# EAGLE schematic termostat_ESP32 (EAGLE 9.0.1)
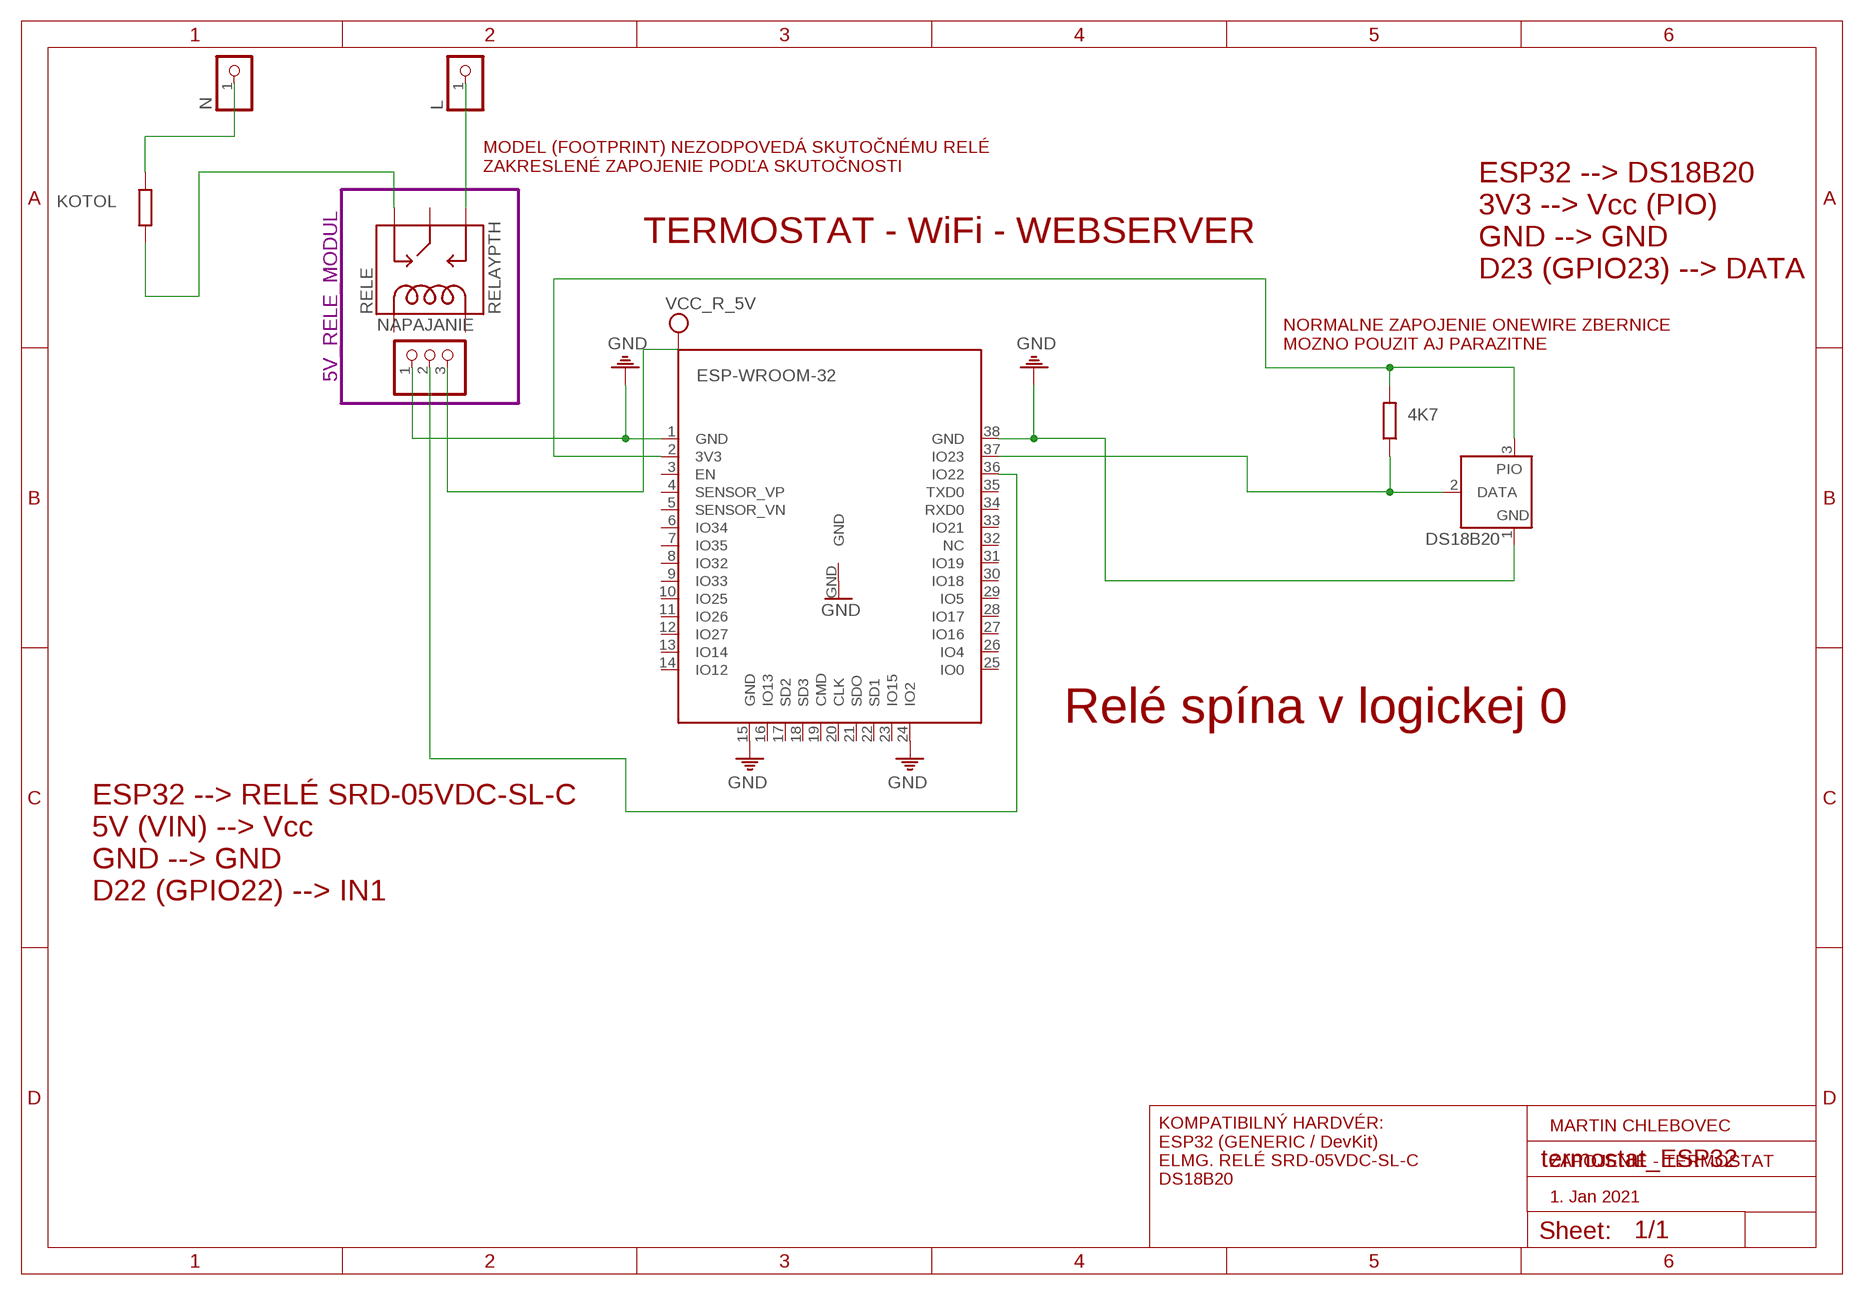
[diagram p0: schematic, sheet 1]

## Parts
IC1  DS2405  [TO92-]
L  PINHD-1X1CB  [1X01-CLEANBIG]
N  PINHD-1X1CB  [1X01-CLEANBIG]
NAPAJANIE  PINHD-1X3  [1X03]
RELE  RELAYPTH  [SRD-05VDC-SL-C]
U1  ESP-WROOM-32  [ESP-WROOM-32]

## Module instances
5V_RELE_MODUL = RELE

## Nets
N$3: NAPAJANIE.2 U1.36(IO22)
N$8: IC1.2(DATA) U1.37(IO23)
N$9: IC1.3(PIO) U1.2(3V3)
N$11: L.1 RELE.SWOPEN
N$12: N.1
N$13: RELE.SWCLOSED(SWCLOSE)
PE [gnd]: IC1.1(GND) NAPAJANIE.1 U1.1(GND) U1.15(GND) U1.24(IO2) U1.38(GND) ; supply symbol labelled GND
VCC: NAPAJANIE.3 ; supply symbol labelled VCC_R_5V
Unconnected: RELE.COIL0 RELE.COIL1 RELE.SWCOMMON U1.3(EN) U1.4(SENSOR_VP) U1.5(SENSOR_VN) U1.6(IO34) U1.7(IO35) U1.8(IO32) U1.9(IO33) U1.10(IO25) U1.11(IO26) U1.12(IO27) U1.13(IO14) U1.14(IO12) U1.16(IO13) U1.17(SD2) U1.18(SD3) U1.19(CMD) U1.20(CLK) U1.21(SDO) U1.22(SD1) U1.23(IO15) U1.25(IO0) U1.26(IO4) U1.27(IO16) U1.28(IO17) U1.29(IO5) U1.30(IO18) U1.31(IO19) U1.32(NC) U1.33(IO21) U1.34(RXD0) U1.35(TXD0) U1.GND

## Notes on the sheet
- MODEL (FOOTPRINT) NEZODPOVEDÁ SKUTOČNÉMU RELÉ
  ZAKRESLENÉ ZAPOJENIE PODĽA SKUTOČNOSTI
- KOTOL
- TERMOSTAT - WiFi - WEBSERVER
- ESP32 --> DS18B20
  3V3 --> Vcc (PIO)
  GND --> GND
  D23 (GPIO23) --> DATA
- NORMALNE ZAPOJENIE ONEWIRE ZBERNICE
  MOZNO POUZIT AJ PARAZITNE
- 4K7
- DS18B20
- Relé spína v logickej 0
- ESP32 --> RELÉ SRD-05VDC-SL-C
  5V (VIN) --> Vcc
  GND --> GND
  D22 (GPIO22) --> IN1
- MARTIN CHLEBOVEC
- ZAPOJENIE - TERMOSTAT
- KOMPATIBILNÝ HARDVÉR:
  ESP32 (GENERIC / DevKit)
  ELMG. RELÉ SRD-05VDC-SL-C
  DS18B20
- 1. Jan 2021

## Library data of the parts
IC1 = maxim:DS2405: Addressable Switch DALLAS Semiconductor; MF: DALLAS SEMICONDUCTOR; MPN: DS2405; OC_FARNELL: 1188025; OC_NEWARK: 06F4645
L N = adafruit:PINHD-1X1: Pin header 1x1 for 0.1" spacing With round pins
NAPAJANIE = pinhead:PINHD-1X3: PIN HEADER
RELE = SRD-05VDC-SL-C:RELAY: SPDT relay (COM-00101)
U1 = esp32:ESP-WROOM-32

## Module LCD
Ports: 

### Library data of the parts

## Module RELE
Ports: 

### Library data of the parts

## Net classes
1 gnd: width 0.635 mm, drill 0.635 mm, clearance 0.254 mm